# Altium project LimePSB-RPCM_1v3.PrjPcb (part 9 of 14)

## Sheet 12_Clock_2.SchDoc: Clock 2
size A3; Organization: Lime Microsystems; Address1: Surrey Tech Centre; Address2: Guildford GU2 7YG; Address3: Surrey; Address4: United Kingdom; Revision: v1.3; SheetNumber: 12; SheetTotal: 15
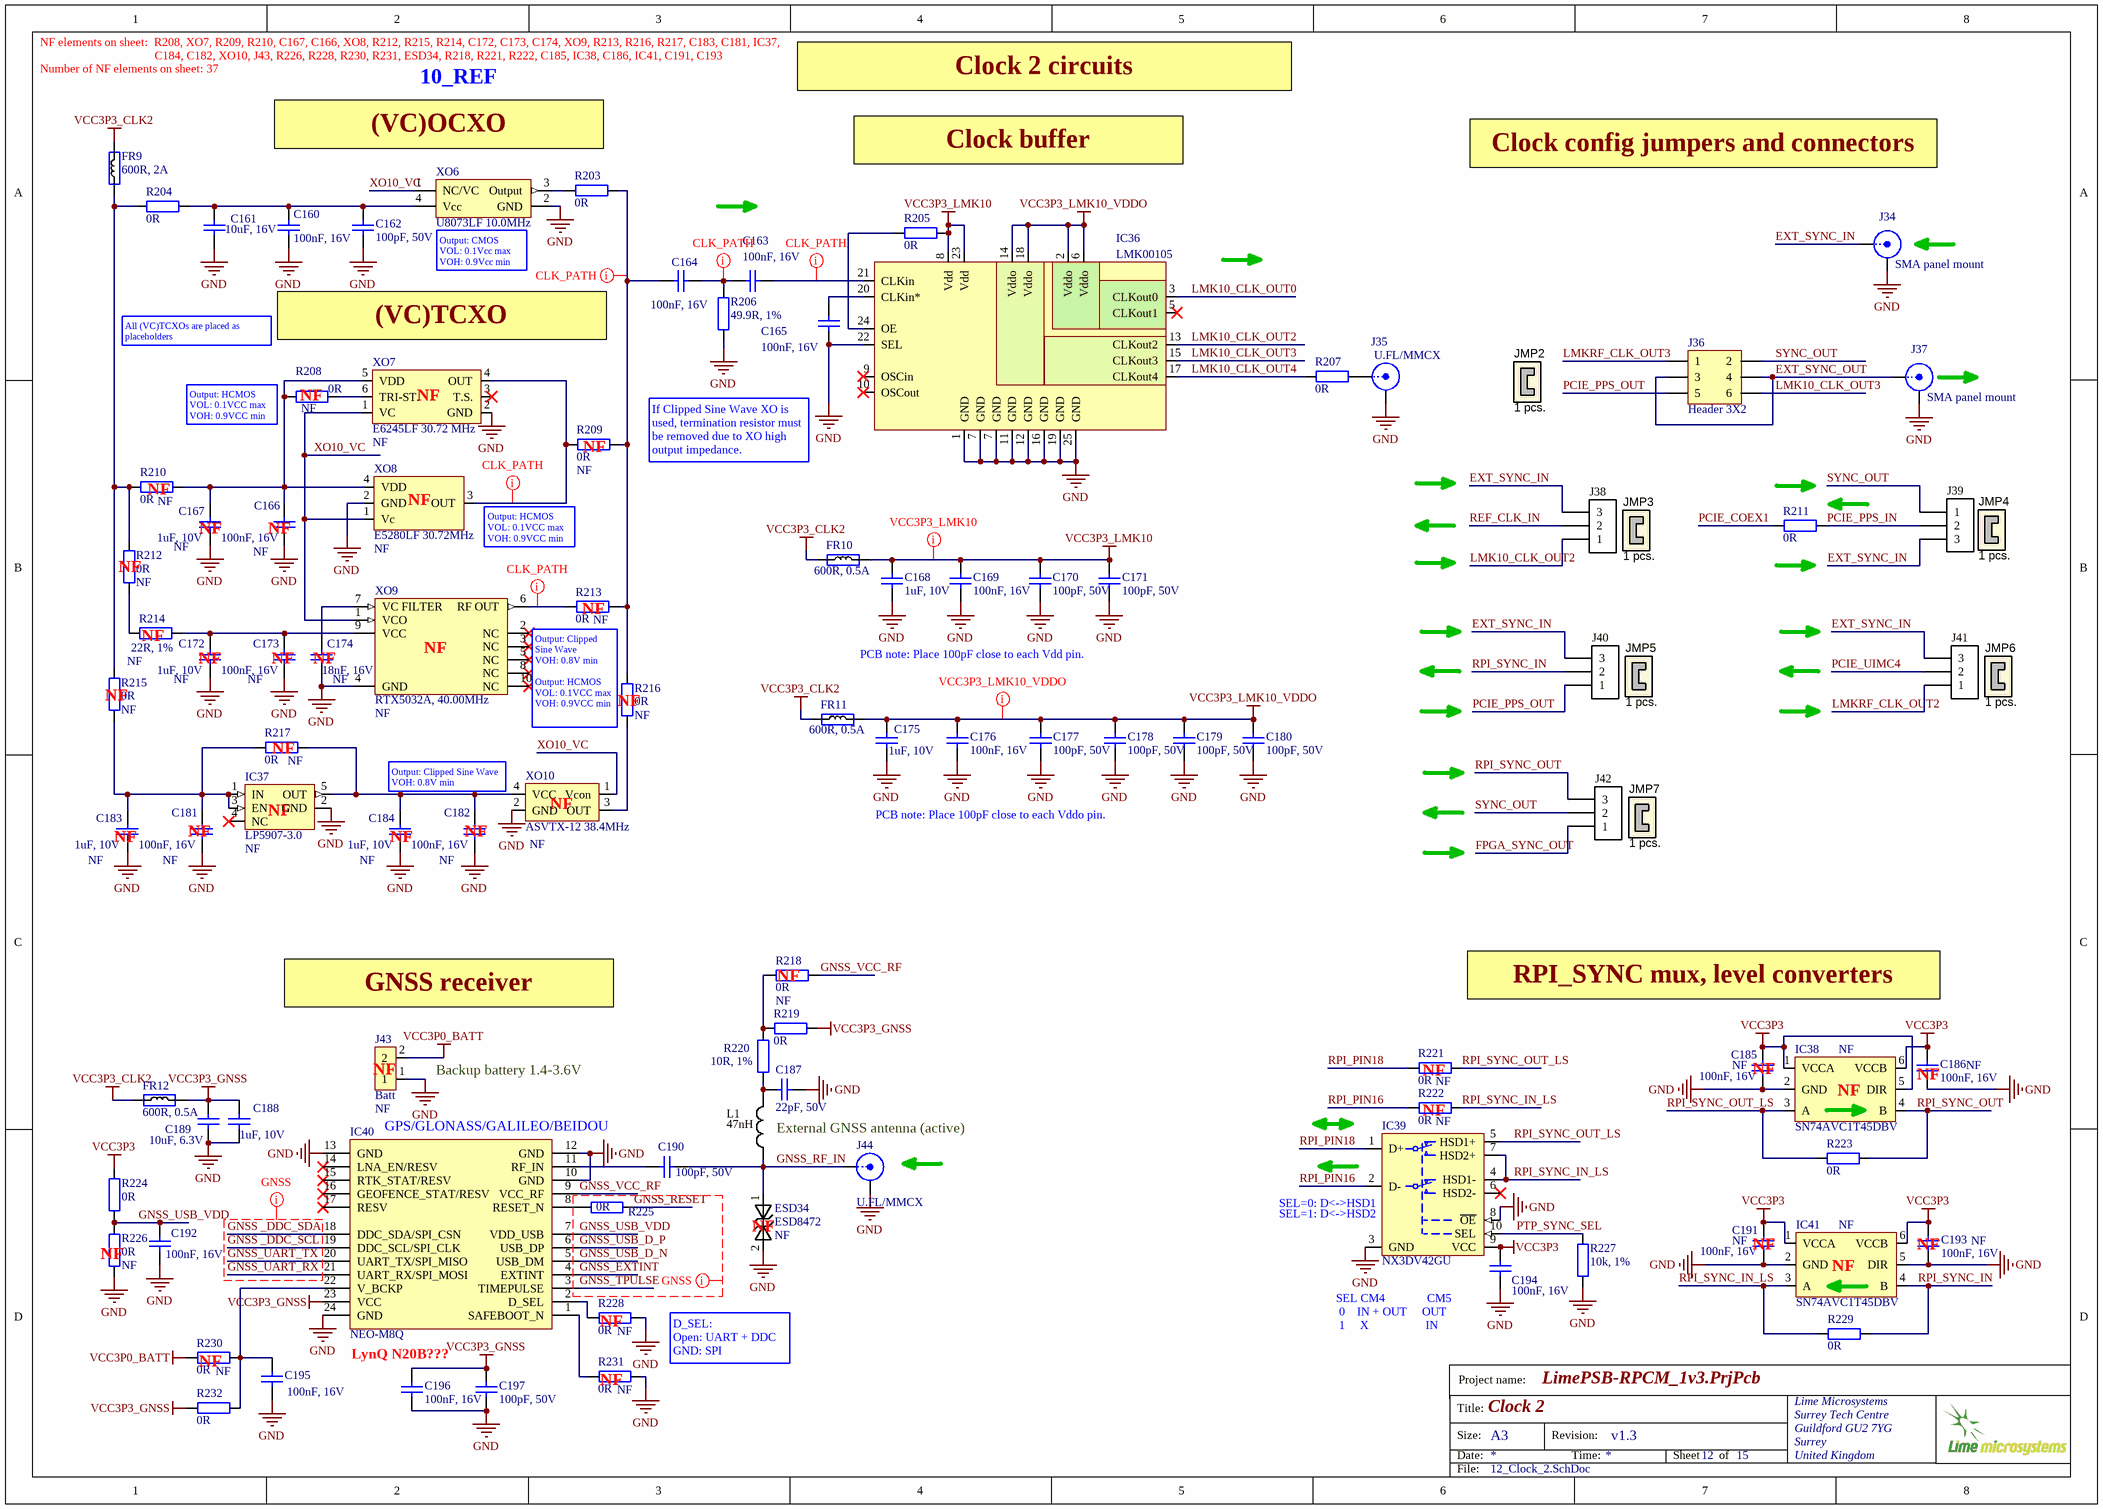
[diagram p11: 12_Clock_2.SchDoc]

### Parts
C160  100nF, 16V  [CAP0402]
C161  10uF, 16V  [CAP0603]
C162  100pF, 50V  [CAP0402]
C163  100nF, 16V  [CAP0402]
C164  100nF, 16V  [CAP0402]
C165  100nF, 16V  [CAP0402]
C166  100nF, 16V  Assembly Info: NF  [CAP0402]
C167  1uF, 10V  Assembly Info: NF  [CAP0402]
C168  1uF, 10V  [CAP0402]
C169  100nF, 16V  [CAP0402]
C170  100pF, 50V  [CAP0402]
C171  100pF, 50V  [CAP0402]
C172  1uF, 10V  Assembly Info: NF  [CAP0402]
C173  100nF, 16V  Assembly Info: NF  [CAP0402]
C174  18nF, 16V  Assembly Info: NF  [CAP0402]
C175  1uF, 10V  [CAP0402]
C176  100nF, 16V  [CAP0402]
C177  100pF, 50V  [CAP0402]
C178  100pF, 50V  [CAP0402]
C179  100pF, 50V  [CAP0402]
C180  100pF, 50V  [CAP0402]
C181  100nF, 16V  Assembly Info: NF  [CAP0402]
C182  100nF, 16V  Assembly Info: NF  [CAP0402]
C183  1uF, 10V  Assembly Info: NF  [CAP0402]
C184  1uF, 10V  Assembly Info: NF  [CAP0402]
C185  100nF, 16V  Assembly Info: NF  [CAP0402]
C186  100nF, 16V  Assembly Info: NF  [CAP0402]
C187  22pF, 50V  [CAP0402]
C188  1uF, 10V  [CAP0402]
C189  10uF, 6.3V  [CAP0603]
C190  100pF, 50V  [CAP0402]
C191  100nF, 16V  Assembly Info: NF  [CAP0402]
C192  100nF, 16V  [CAP0402]
C193  100nF, 16V  Assembly Info: NF  [CAP0402]
C194  100nF, 16V  [CAP0402]
C195  100nF, 16V  [CAP0402]
C196  100nF, 16V  [CAP0402]
C197  100pF, 50V  [CAP0402]
ESD34  ESD8472  Assembly Info: NF  [ESD8472_X3DFN2]
FR9  600R, 2A  [RES0805]
FR10  600R, 0.5A  [RES0402]
FR11  600R, 0.5A  [RES0402]
FR12  600R, 0.5A  [RES0402]
IC36  LMK00105  [LMK00105SQ]
IC37  LP5907-3.0  Assembly Info: NF  [SOT23-5]
IC38  SN74AVC1T45DBV  Assembly Info: NF  [SOT23-6]
IC39  NX3DV42GU  [FSUSB42UMX]
IC40  NEO-M8Q  [NEO-7M/8M]
IC41  SN74AVC1T45DBV  Assembly Info: NF  [SOT23-6]
J34  SMA panel mount  [SMA_connector_side]
J35  U.FL/MMCX  [MMCX_UFL_conn_u]
J36  Header 3X2  [Header3x2]
J37  SMA panel mount  [SMA_connector_side]
J38  Header 3x1 pin  [HDR_1x3]  (value not drawn)
J39  Header 3x1 pin  [HDR_1x3]  (value not drawn)
J40  Header 3x1 pin  [HDR_1x3]  (value not drawn)
J41  Header 3x1 pin  [HDR_1x3]  (value not drawn)
J42  Header 3x1 pin  [HDR_1x3]  (value not drawn)
J43  Batt  Assembly Info: NF  [HDR_1x2]
J44  U.FL/MMCX  [MMCX_UFL_conn_u]
JMP2  1 pcs.  (mechanical)
JMP3  1 pcs.  (mechanical)
JMP4  1 pcs.  (mechanical)
JMP5  1 pcs.  (mechanical)
JMP6  1 pcs.  (mechanical)
JMP7  1 pcs.  (mechanical)
L1  47nH  [RES0402]
R203  0R  [RES0402_v2]
R204  0R  [RES0402]
R205  0R  [RES0402]
R206  49.9R, 1%  [RES0402]
R207  0R  [RES0402]
R208  0R  Assembly Info: NF  [RES0402]
R209  0R  Assembly Info: NF  [RES0402_v2]
R210  0R  Assembly Info: NF  [RES0402]
R211  0R  [RES0402]
R212  0R  Assembly Info: NF  [RES0402]
R213  0R  Assembly Info: NF  [RES0402_v2]
R214  22R, 1%  Assembly Info: NF  [RES0402]
R215  0R  Assembly Info: NF  [RES0402]
R216  0R  Assembly Info: NF  [RES0402_v2]
R217  0R  Assembly Info: NF  [RES0402]
R218  0R  Assembly Info: NF  [RES0402]
R219  0R  [RES0402]
R220  10R, 1%  [RES0402]
R221  0R  Assembly Info: NF  [RES0402]
R222  0R  Assembly Info: NF  [RES0402]
R223  0R  [RES0402]
R224  0R  [RES0402]
R225  0R  [RES0402]
R226  0R  Assembly Info: NF  [RES0402]
R227  10k, 1%  [RES0402]
R228  0R  Assembly Info: NF  [RES0402]
R229  0R  [RES0402]
R230  0R  Assembly Info: NF  [RES0402]
R231  0R  Assembly Info: NF  [RES0402]
R232  0R  [RES0402]
XO6  U8073LF 10.0MHz  [AOCJYR-10.000MHz]
XO7  E6245LF 30.72 MHz  Assembly Info: NF  [RAKON_RPT7050A]
XO8  E5280LF 30.72MHz  Assembly Info: NF  [RAKON_TXCO]
XO9  RTX5032A, 40.00MHz  Assembly Info: NF  [RAKON_RTX5032A]
XO10  ASVTX-12 38.4MHz  Assembly Info: NF  [CRYSTAL_4-LCC_2P5x2P0]

### Nets
GND: C160.1 C161.1 C162.2 C165.1 C166.1 C167.1 C168.1 C169.1 C170.1 C171.1 C172.1 C173.1 C174.1 C175.1 C176.1 C177.1 C178.1 C179.1 C180.1 C181.1 C182.1 C183.1 C184.1 C185.2 C186.2 C187.1 C188.1 C189.1 C191.2 C192.2 C193.2 C194.2 C195.2 C196.1 C197.2 ESD34.2 IC36.1(GND) IC36.7(GND) IC36.11(GND) IC36.12(GND) IC36.16(GND) IC36.19(GND) IC36.22(SEL) IC36.25(GND) IC37.2(GND) IC38.2(GND) IC39.3(GND) IC39.8(~{OE}) IC40.10(GND) IC40.12(GND) IC40.13(GND) IC40.24(GND) IC41.2(GND) IC41.5(DIR) J34.2(Y) J35.2(Y) J37.2(Y) J43.1 J44.2(Y) R206.1 R226.1 R227.2 R228.1 R231.1 XO6.2(GND) XO7.2(GND) XO8.2(GND) XO9.4(GND) XO10.2(GND)
VCC3P0_BATT: J43.2 R230.2
VCC3P3: C185.1 C186.1 C191.1 C193.1 C194.1 IC38.1(VCCA) IC38.5(DIR) IC38.6(VCCB) IC39.9(VCC) IC41.1(VCCA) IC41.6(VCCB) R224.1
VCC3P3_CLK2: FR9.1 FR10.1 FR11.1 FR12.1
VCC3P3_GNSS: C188.2 C189.2 C196.2 C197.1 FR12.2 IC40.23(VCC) R219.1 R232.2
VCC3P3_LMK10: C168.2 C169.2 C170.2 C171.2 FR10.2 IC36.8(Vdd) IC36.23(Vdd) R205.2
VCC3P3_LMK10_VDDO: C175.2 C176.2 C177.2 C178.2 C179.2 C180.2 FR11.2 IC36.2(Vddo) IC36.6(Vddo) IC36.14(Vddo) IC36.18(Vddo)
EXT_SYNC_IN: J34.1(X) J38.3 J39.3 J40.3 J41.3
EXT_SYNC_OUT: J36.3 J36.4 J37.1(X)
FPGA_SYNC_OUT: J42.1
GNSS _DDC_SCL: IC40.19(DDC_SCL/SPI_CLK)
GNSS _DDC_SDA: IC40.18(DDC_SDA/SPI_CSN)
GNSS_EXTINT: IC40.4(EXTINT)
GNSS_RESET: R225.1
GNSS_RF_IN: C190.1 ESD34.1 J44.1(X) L1.1
GNSS_TPULSE: IC40.3(TIMEPULSE)
GNSS_UART_RX: IC40.21(UART_RX/SPI_MOSI)
GNSS_UART_TX: IC40.20(UART_TX/SPI_MISO)
GNSS_USB_D_N: IC40.5(USB_DM)
GNSS_USB_D_P: IC40.6(USB_DP)
GNSS_USB_VDD: C192.1 IC40.7(VDD_USB) R224.2 R226.2
GNSS_VCC_RF: IC40.9(VCC_RF) R218.2
LMK10_CLK_OUT0: IC36.3(CLKout0)
LMK10_CLK_OUT2: IC36.13(CLKout2) J38.1
LMK10_CLK_OUT3: IC36.15(CLKout3) J36.6
LMK10_CLK_OUT4: IC36.17(CLKout4) R207.2
LMKRF_CLK_OUT2: J41.1
LMKRF_CLK_OUT3: J36.1
PCIE_COEX1: R211.2
PCIE_PPS_IN: J39.2 R211.1
PCIE_PPS_OUT: J36.5 J40.1
PCIE_UIMC4: J41.2
PTP_SYNC_SEL: IC39.10(SEL) R227.1
REF_CLK_IN: J38.2
RPI_PIN16: IC39.2(D-) R222.2
RPI_PIN18: IC39.1(D+) R221.2
RPI_SYNC_IN: IC41.4(B) J40.2 R229.1
RPI_SYNC_IN_LS: IC39.4(HSD1-) IC39.7(HSD2+) IC41.3(A) R222.1 R229.2
RPI_SYNC_OUT: IC38.4(B) J42.3 R223.1
RPI_SYNC_OUT_LS: IC38.3(A) IC39.5(HSD1+) R221.1 R223.2
SYNC_OUT: J36.2 J39.1 J42.2
XO10_VC: XO6.1(NC/VC) XO7.1(VC) XO8.1(Vc) XO9.1(VCO) XO10.1(Vcon)
NetC160_2: C160.2 C161.2 C162.1 R204.2 XO6.4(Vcc)
NetC163_1: C163.1 IC36.21(CLKin)
NetC163_2: C163.2 C164.1 R206.2
NetC164_2: C164.2 R203.1 R209.1 R213.2 R216.1
NetC165_2: C165.2 IC36.20(CLKin*)
NetC166_2: C166.2 C167.2 R208.2 R210.1 XO7.5(VDD) XO8.4(VDD)
NetC172_2: C172.2 C173.2 R214.2 XO9.9(VCC)
NetC174_2: C174.2 XO9.7(VC_FILTER)
NetC181_2: C181.2 C183.2 IC37.1(IN) IC37.3(EN) R215.2 R217.2
NetC182_2: C182.2 C184.2 IC37.5(OUT) R217.1 XO10.4(VCC)
NetC187_2: C187.2 L1.2 R220.1
NetC190_2: C190.2 IC40.11(RF_IN)
NetC195_1: C195.1 IC40.22(V_BCKP) R230.1 R232.1
NetFR9_2: FR9.2 R204.1 R210.2 R212.1 R215.1
NetIC36_24: IC36.24(OE) R205.1
NetIC40_1: IC40.1(SAFEBOOT_N) R231.2
NetIC40_2: IC40.2(D_SEL) R228.2
NetIC40_8: IC40.8(RESET_N) R225.2
NetJ35_1: J35.1(X) R207.1
NetR203_2: R203.2 XO6.3(Output)
NetR208_1: R208.1 XO7.6(TRI-ST.)
NetR209_2: R209.2 XO7.4(OUT) XO8.3(OUT)
NetR212_2: R212.2 R214.1
NetR213_1: R213.1 XO9.6(RF_OUT)
NetR216_2: R216.2 XO10.3(OUT)
NetR218_1: R218.1 R219.2 R220.2

Not connected (* = marked no-connect by the designer): IC36 5(CLKout1)* 9(OSCin)* 10(OSCout)*; IC37 4(NC)*; IC39 6(HSD2-)*; IC40 14(LNA_EN/RESV)* 15(RTK_STAT/RESV)* 16(GEOFENCE_STAT/RESV)* 17(RESV)*; JMP2 1 2; JMP3 1 2; JMP4 1 2; JMP5 1 2; JMP6 1 2; JMP7 1 2; XO7 3(T.S.)*; XO9 2(NC)* 3(NC)* 5(NC)* 8(NC)* 10(NC)*

### Layout directives
net class CLK_PATH: NetC163_1, NetC163_2, NetC164_2, NetR209_2, NetR213_1
net class VCC3P3_LMK10: VCC3P3_LMK10
net class VCC3P3_LMK10_VDDO: VCC3P3_LMK10_VDDO
net class GNSS: GNSS _DDC_SCL, GNSS _DDC_SDA, GNSS_EXTINT, GNSS_RESET, GNSS_TPULSE, GNSS_UART_RX, GNSS_UART_TX, GNSS_USB_D_N, GNSS_USB_D_P, GNSS_USB_VDD

### Notes on the sheet
- NF elements on sheet:  R208, XO7, R209, R210, C167, C166, XO8, R212, R215, R214, C172, C173, C174, XO9, R213, R216, R217, C183, C181, IC37,
- Number of NF elements on sheet: 37
- C184, C182, XO10, J43, R226, R228, R230, R231, ESD34, R218, R221, R222, C185, IC38, C186, IC41, C191, C193
- 10_REF
- Clock 2 circuits
- (VC)OCXO
- Clock buffer
- Clock config jumpers and connectors
- (near XO6) Output: CMOS
  VOL: 0.1Vcc max
  VOH: 0.9Vcc min
- All (VC)TCXOs are placed as placeholders
- (VC)TCXO
- (near R208) Output: HCMOS
  VOL: 0.1VCC max
  VOH: 0.9VCC min
- (near R208) NF
- (near XO7) NF
- (near R209) NF
- (near R210) NF
- (near XO8) NF
- (near R209) If Clipped Sine Wave XO is used, termination resistor must be removed due to XO high output impedance.
- (near R212) NF
- (near C167) NF
- (near C166) NF
- (near XO8) Output: HCMOS
  VOL: 0.1VCC max
  VOH: 0.9VCC min
- (near R214) NF
- (near XO9) NF
- (near R213) NF
- (near R215) NF
- (near C172) NF
- (near C173) NF
- (near C174) NF
- (near R216) Output: Clipped Sine Wave
  VOH: 0.8V min
  Output: HCMOS
  VOL: 0.1VCC max
  VOH: 0.9VCC min
- (near R216) NF
- PCB note: Place 100pF close to each Vdd pin.
- (near R217) NF
- Output: Clipped Sine Wave
  VOH: 0.8V min
- (near C183) NF
- (near C181) NF
- (near IC37) NF
- (near C184) NF
- (near C182) NF
- (near XO10) NF
- PCB note: Place 100pF close to each Vddo pin.
- (near R218) NF
- (near J43) GNSS receiver
- RPI_SYNC mux, level converters
- (near J43) NF
- (near J43) Backup battery 1.4-3.6V
- (near R221) NF
- (near R222) NF
- (near C185) NF
- (near IC38) NF
- (near C186) NF
- (near IC40) GPS/GLONASS/GALILEO/BEIDOU
- (near L1) External GNSS antenna (active)
- (near R226) NF
- (near ESD34) NF
- (near IC39) SEL=0: D<->HSD1
- (near IC39) SEL=1: D<->HSD2
- (near C191) NF
- (near C193) NF
- (near R228) NF
- (near IC41) NF
- (near R230) NF
- LynQ N20B???
- (near R231) NF
- D_SEL:
  Open: UART + DDC
  GND: SPI
- (near C194) SEL CM4              CM5
  0    IN + OUT     OUT
  1     X                   IN
- Project name:
- Title:
- Size:
- Date:
- A3
- Revision:
- Time:
- Sheet
- of
- File:

### Library data of the parts
C160 C163-C166 C169 C173 C176 C185 C186 C191 C193 C194 = Cap_0402: as C101-C108 on sheet 10_USB_HDMI; Value: 100nF, 16V; Supplier 1: Mouser; Supplier Part Number 1: 81-GRM155R71C104KA88; Case Code - in: 0402; RoHS: RoHS Compliant; Operating Temperature Range: - 55 C to + 125 C; Series: GRM; Termination Style: SMD/SMT; Package / Case: 0402 (1005 metric); Voltage Rating DC: 16 V; Maximum Operating Temperature: + 125 C; Case Code - mm: 1005; Minimum Operating Temperature: - 55 C; Product Category: Low & Medium Capacitance SMD Ceramic Chip Capacitors; Packaging: Reel; Product: General Type MLCCs; Category: Multilayer Ceramic Capacitors MLCC - SMD/SMT; Brand: Murata Electronics; Case Width: 0.5 mm; RoHS - Mouser: Y; Standard Pack Qty: 10000; Minimum Order Quantity: 1; Reeling: True; Manufacturer Part Number 1: GRM155R71C104KA88D
C161 = Cap_0603: as C110 on sheet 11_Clock_1; Value: 10uF, 16V; Supplier 1: Digi-Key; Supplier Part Number 1: 490-7201-2-ND; Category: Capacitors; Ratings: -; Features: -; Lead Style: -; Package / Case: 0603 (1608 Metric); Lead Spacing: -; Applications: General Purpose; Voltage - Rated: 16V; Operating Temperature: -55°C ~ 85°C; Thickness (Max): 0.039" (1.00mm); Mounting Type: Surface Mount, MLCC; RoHS: RoHS Compliant; Size / Dimension: 0.063" L x 0.031" W (1.60mm x 0.80mm); Packaging: Tape & Reel (TR); Height - Seated (Max): -
C162 C190 C197 = Cap_0402: as C111 on sheet 11_Clock_1; Value: 100pF, 50V; Capacitance: 100pF; Thickness (Max): 0.022" (0.55mm); Size / Dimension: 0.039" L x 0.020" W (1.00mm x 0.50mm); RoHS: RoHS Compliant; Ratings: -; Package / Case: 0402 (1005 Metric); Mounting Type: Surface Mount, MLCC; Height - Seated (Max): -; Features: -; Lead Spacing: -; Voltage - Rated: 50V; Operating Temperature: -55°C ~ 125°C; Packaging: Cut Tape (CT); Applications: General Purpose; Lead Style: -; Supplier 1: Digi-Key; Category: Capacitors; Supplier Part Number 1: 311-1024-1-ND
C167 C172 = Cap_0402: as C116 on sheet 11_Clock_1; Value: 1uF, 10V; Supplier 1: Digi-Key; Supplier Part Number 1: 311-1732-1-ND; RoHS: YES; MSL: -
C168 C175 C188 = Cap_0402: as C117 on sheet 11_Clock_1; Value: 1uF, 10V; Supplier 1: Digi-Key; Supplier Part Number 1: 311-1732-1-ND; RoHS: RoHS Compliant; Applications: General Purpose; Category: Capacitors; ComponentLink1Description: http://www.yageo.com/documents/recent/UPY-GPHC_X5R_4V-to-50V_25.pdf; ComponentLink1URL: http://www.yageo.com/documents/recent/UPY-GPHC_X5R_4V-to-50V_25.pdf; Failure Rate: -; Features: -; Height - Seated (Max): -; Lead Spacing: -; Lead Style: -; Mounting Type: Surface Mount, MLCC; Operating Temperature: -55°C ~ 85°C; Package / Case: 0402 (1005 Metric); Packaging: Cut Tape (CT); Part Status: Active; Pricing 1: 1=0.22, 10=0.156, 100=0.0732, 500=0.0513, 1000=0.04248, 2500=0.03953, 5000=0.03617 (USD); Ratings: -; Size / Dimension: 0.039" L x 0.020" W (1.00mm x 0.50mm); Stock 1: 69600; Temperature Coefficient: X5R; Thickness (Max): 0.022" (0.55mm); Voltage - Rated: 10V
C170 C171 C177-C180 = Cap_0402: as C119 on sheet 11_Clock_1; Value: 100pF, 50V; Supplier 1: Digi-Key; Supplier Part Number 1: 311-1024-1-ND; RoHS: RoHS Compliant; Category: Capacitors; Applications: General Purpose; Mounting Type: Surface Mount, MLCC; Capacitance: 100pF; Ratings: -; Packaging: Cut Tape (CT); Voltage - Rated: 50V; Size / Dimension: 0.039" L x 0.020" W (1.00mm x 0.50mm); Height - Seated (Max): -; Package / Case: 0402 (1005 Metric); Operating Temperature: -55°C ~ 125°C; Features: -; Lead Spacing: -; Lead Style: -; Thickness (Max): 0.022" (0.55mm)
C174 = Cap_0402: as C123 on sheet 11_Clock_1; Value: 18nF, 16V; Supplier 1: Digi-Key; Supplier Part Number 1: 311-1706-1-ND; Part Status: Active; Category: Capacitors; Packaging: Cut Tape (CT); Voltage - Rated: 16V; RoHS: RoHS Compliant; Size / Dimension: 0.039" L x 0.020" W (1.00mm x 0.50mm); Package / Case: 0402 (1005 Metric); Mounting Type: Surface Mount, MLCC; Thickness (Max): 0.022" (0.55mm); Applications: General Purpose; Operating Temperature: -55°C ~ 125°C
C181 C182 = Cap_0402: as C93 on sheet 10_USB_HDMI; Value: 100nF, 16V; Supplier 1: Mouser; Supplier Part Number 1: 81-GRM155R71C104KA88; Case Code - in: 0402; RoHS: RoHS Compliant; Operating Temperature Range: - 55 C to + 125 C; Series: GRM; Termination Style: SMD/SMT; Package / Case: 0402 (1005 metric); Voltage Rating DC: 16 V; Maximum Operating Temperature: + 125 C; Case Code - mm: 1005; Minimum Operating Temperature: - 55 C; Product Category: Low & Medium Capacitance SMD Ceramic Chip Capacitors; Packaging: Reel; Product: General Type MLCCs; Category: Multilayer Ceramic Capacitors MLCC - SMD/SMT; Brand: Murata Electronics; Case Width: 0.5 mm; RoHS - Mouser: Y; Standard Pack Qty: 10000; Minimum Order Quantity: 1; Reeling: True; Manufacturer Part Number: GRM155R71C104KA88D
C183 C184 = Cap_0402: as C92 on sheet 10_USB_HDMI; Value: 1uF, 10V; Supplier 1: Digi-Key; Supplier Part Number 1: 311-1732-1-ND; MSL: -; RoHS: YES
C187 = Cap_0402: as C154-C156 on sheet 11_Clock_1; Value: 22pF, 50V; Supplier 1: Digi-Key; Supplier Part Number 1: 311-1018-2-ND; Category: Capacitors; Voltage - Rated: 50V; Packaging: Tape & Reel (TR); RoHS: RoHS Compliant; Capacitance: 22pF; Operating Temperature: -55°C ~ 125°C; Mounting Type: Surface Mount, MLCC; Height - Seated (Max): -; Size / Dimension: 0.039" L x 0.020" W (1.00mm x 0.50mm); Ratings: -; Applications: General Purpose; Thickness (Max): 0.022" (0.55mm); Lead Spacing: -; Lead Style: -; Features: -; Package / Case: 0402 (1005 Metric)
C189 = Cap_0603: Manufacturer Part Number 1: CC0603MRX5R5BB106; Manufacturer: Yageo; Part Description: 10µF ±20% 6.3V X5R Ceramic Capacitor -55°C ~ 85°C Surface Mount, MLCC 0603 (1608 Metric) 0.063" L x 0.031" W (1.60mm x 0.80mm); Capacitance: 10µF; Tolerance: ±20%; Supplier 1: Digi-Key; Supplier Part Number 1: 311-1448-2-ND; Package / Case: 0603 (1608 Metric); Category: Capacitors; Voltage - Rated: 6.3V; Value: 10uF, 6.3V
C192 C195 = Cap_0603: Manufacturer Part Number 1: GRM155R71C104KA88D; Part Description: 0.10µF ±10% 16V X7R Ceramic Capacitor -55°C ~ 125°C Surface Mount, MLCC 0402 (1005 Metric) 0.039" L x 0.020" W (1.00mm x 0.50mm); Brand: Murata Electronics; Tolerance: 10 %; Type: General Purpose MLCC; Capacitance: 0.1 uF; Temperature Coefficient / Code: +/- 15 %; Case Height: 0.5 mm; Case Length: 1 mm; Dielectric: X7R; Supplier 1: Mouser; Supplier Part Number 1: 81-GRM155R71C104KA88; Case Code - in: 0402; Manufacturer: Murata Electronics; Category: Multilayer Ceramic Capacitors MLCC - SMD/SMT; Voltage Rating DC: 16 V; Value: 100nF, 16V; Manufacturer Part Number: GRM155R71C104KA88D; Case Code - mm: 1005; Case Width: 0.5 mm; Maximum Operating Temperature: + 125 C; Minimum Operating Temperature: - 55 C; Minimum Order Quantity: 1; Operating Temperature Range: - 55 C to + 125 C; Package / Case: 0402 (1005 metric); Packaging: Reel; Product: General Type MLCCs; Product Category: Low & Medium Capacitance SMD Ceramic Chip Capacitors; Reeling: True; RoHS - Mouser: Y; RoHS: RoHS Compliant; Series: GRM; Standard Pack Qty: 10000; Termination Style: SMD/SMT
C196 = Cap_0402: Manufacturer: Murata Electronics; Manufacturer Part Number: GRM155R71C104KA88D; Part Description: 0.10µF ±10% 16V X7R Ceramic Capacitor -55°C ~ 125°C Surface Mount, MLCC 0402 (1005 Metric) 0.039" L x 0.020" W (1.00mm x 0.50mm); Tolerance: 10 %; Type: General Purpose MLCC; Capacitance: 0.1 uF; Case Length: 1 mm; Dielectric: X7R; Case Height: 0.5 mm; Temperature Coefficient / Code: +/- 15 %; Value: 100nF, 16V; Supplier 1: Mouser; Supplier Part Number 1: 81-GRM155R71C104KA88; Case Code - in: 0402; RoHS: RoHS Compliant; Operating Temperature Range: - 55 C to + 125 C; Series: GRM; Termination Style: SMD/SMT; Package / Case: 0402 (1005 metric); Voltage Rating DC: 16 V; Maximum Operating Temperature: + 125 C; Case Code - mm: 1005; Minimum Operating Temperature: - 55 C; Product Category: Low & Medium Capacitance SMD Ceramic Chip Capacitors; Packaging: Reel; Product: General Type MLCCs; Category: Multilayer Ceramic Capacitors MLCC - SMD/SMT; Brand: Murata Electronics; Case Width: 0.5 mm; RoHS - Mouser: Y; Standard Pack Qty: 10000; Minimum Order Quantity: 1; Reeling: True; Manufacturer Part Number 1: GRM155R71C104KA88D
ESD34 = ESD8472: Manufacturer: ON Semiconductor; Manufacturer Part Number: ESD8472MUT5G; Part Description: TVS DIODE 5.3VWM 14VC X3DFN2; Voltage - Reverse Standoff (Typ): 5.3V (Max); Voltage - Breakdown (Min): 7V; Voltage - Clamping (Max) @ Ipp: 14V; Current - Peak Pulse (10/1000µs): 3A (8/20µs); Power Line Protection: No; Capacitance @ Frequency: 0.2pF @ 1MHz; Supplier 1: Digi-Key; RoHS: RoHS Compliant; Category: Circuit Protection; Stock 1: 2295; Pricing 1: 1=0.39, 10=0.315, 100=0.2142, 500=0.16068, 1000=0.12051 (USD); Packaging: Cut Tape (CT); Part Status: Active; Type: Zener; Power - Peak Pulse: -; Applications: Automotive, RF Antenna; Operating Temperature: -55°C ~ 150°C (TJ); Mounting Type: Surface Mount; Package / Case: 2-XFDFN; Supplier Device Package: 2-X3DFN (0.62x0.32); ComponentLink1URL: http://www.onsemi.com/pub/Collateral/ESD8472-D.PDF; ComponentLink1Description: http://www.onsemi.com/pub/Collateral/ESD8472-D.PDF; Supplier Part Number 1: ESD8472MUT5GOSCT-ND; Manufacturer Part Number 1: ESD8472MUT5G
FR9 = Ferrite: as FR4 on sheet 11_Clock_1; Supplier 1: Digi-Key; Supplier Part Number 1: 445-2206-2-ND; Value: 600R, 2A; Category: Filters; Current Rating: 2A; Height (Max): 0.041" (1.05mm); Mounting Type: Surface Mount; Package / Case: 0805 (2012 Metric); Packaging: Tape & Reel (TR); RoHS: RoHS Compliant; Size / Dimension: 0.079" L x 0.049" W (2.00mm x 1.25mm)
FR10-FR12 = Ferrite: as FR5-FR8 on sheet 11_Clock_1; Value: 600R, 0.5A; Supplier 1: Digi-Key; Supplier Part Number 1: 490-5441-1-ND; Stock 1: 416370; Pricing 1: 1=0.1, 10=0.06, 25=0.0552, 50=0.0496, 100=0.0363, 250=0.0264, 500=0.0242, 1000=0.0209, 5000=0.0165 (USD); Case/Package: 0402; Number of Pins: 2; Case Code (Metric): 1005; Case Code (Imperial): 0402; Core Material: Ferrite; Material: Steel,Ferrite; Min Operating Temperature: -55°C; Max Operating Temperature: 125°C; Package Quantity: 1; Packaging: Tape and Reel; Series: BLM15AX_SN; Impedance: 600R; Max Current Rating: 500mA; Termination: SMD/SMT; Max DC Current: 500mA; Number of Circuits: 1; DC Resistance-Max: 340mR; Length: 1mm; Width: 0.5mm; Height: 0.5mm; Depth: 0.5mm; REACH SVHC: No SVHC; Lead Free: Lead Free; RoHS Compliant: Yes; ComponentLink1URL: https://www.murata.com/en-us/products/productdata/8796740059166/ENFA0018.pdf?src-supplier=Digi-Key; ComponentLink1Description: https://www.murata.com/en-us/products/productdata/8796740059166/ENFA0018.pdf?src-supplier=Digi-Key; ComponentLink2URL: http://search.murata.co.jp/Ceramy/image/img/PDF/ENG/L0110S0100BLM15AX_SN.pdf?src-supplier=Future+Electronics; ComponentLink2Description: http://search.murata.co.jp/Ceramy/image/img/PDF/ENG/L0110S0100BLM15AX_SN.pdf?src-supplier=Future+Electronics; ComponentLink3URL: http://www.produktinfo.conrad.com/datenblaetter/1100000-1199999/001171675-da-01-en-CHIP_DROSSEL0402_600R_420MA_1_0X0_5MM.pdf?src-supplier=Conrad; ComponentLink3Description: http://www.produktinfo.conrad.com/datenblaetter/1100000-1199999/001171675-da-01-en-CHIP_DROSSEL0402_600R_420MA_1_0X0_5MM.pdf?src-supplier=Conrad; ComponentLink4URL: http://www.produktinfo.conrad.com/datenblaetter/1100000-1199999/001172169-da-01-en-DROSSEL_0402_600R_1_0X0_5MM_10000ST.pdf?src-supplier=Conrad; ComponentLink4Description: http://www.produktinfo.conrad.com/datenblaetter/1100000-1199999/001172169-da-01-en-DROSSEL_0402_600R_1_0X0_5MM_10000ST.pdf?src-supplier=Conrad
IC36 = LMK00105: as IC30 on sheet 11_Clock_1; Supplier 1: Digi-Key; Type: Fanout Buffer (Distribution), Multiplexer, Translator; Category: Integrated Circuits (ICs); Operating Temperature: -40°C ~ 85°C; Package / Case: 24-WFQFN Exposed Pad; Supplier Device Package: 24-WQFN (4x4); Supplier Part Number 1: LMK00105SQ/NOPBCT-ND
IC37 = LP5907: as IC31 on sheet 11_Clock_1; Supplier 1: Digi-Key; Stock 1: 90911; Pricing 1: 1 = 0,65000, 10 = 0,56000, 100 = 0,41820, 500 = 0,32858, 1000 = 0,25390 (USD); RoHS: Yes; Mount: Surface Mount; Case/Package: SOT-23-5; Min Operating Temperature: -40°C; Max Operating Temperature: 125°C; Packaging: Tape and Reel; Output Current: 250mA; Number of Regulators: 1; Radiation Hardening: No; Lead Free: Lead Free; ComponentLink1URL: https://datasheet.ciiva.com/48677/lp5907-q1-48677562.pdf?src-supplier=Avnet; ComponentLink1Description: https://datasheet.ciiva.com/48677/lp5907-q1-48677562.pdf?src-supplier=Avnet; Supplier Part Number 1: 296-40364-1-ND
IC38 IC41 = SN74AVC1T45DBV: Manufacturer: Texas Instruments; Manufacturer Part Number 1: SN74AXC1T45DBVR; Part Description: Voltage Level Translator Bidirectional 1 Circuit 1 Channel 500Mbps SOT-23-6; Number of Bits: 1; Channel Type: Bidirectional; Data Rate: 500Mbps; Supplier 1: Digi-Key; Supplier Part Number 1: 296-47598-1-ND; Stock 1: 116252; Pricing 1: 1=0,68000, 10=0,59800, 25=0,56200, 100=0,45860, 250=0,42596, 500=0,36252, 1000=0,29002 (USD); RoHS: Yes; Mount: Surface Mount; Case/Package: SOT-23-6; Min Operating Temperature: -40°C; Max Operating Temperature: 125°C; Packaging: Cut Tape; Number of Circuits: 1; RoHS Compliant: Yes; ComponentLink1URL: http://www.ti.com/lit/ds/symlink/sn74axc1t45.pdf?src-supplier=Digi-Key; ComponentLink1Description: http://www.ti.com/lit/ds/symlink/sn74axc1t45.pdf?src-supplier=Digi-Key; ComponentLink2URL: http://www.ti.com/general/docs/suppproductinfo.tsp?distId=10&amp;gotoUrl=http%3A%2F%2Fwww.ti.com%2Flit%2Fgpn%2Fsn74axc1t45&src-supplier=Digi-Key; ComponentLink2Description: http://www.ti.com/general/docs/suppproductinfo.tsp?distId=10&amp;gotoUrl=http%3A%2F%2Fwww.ti.com%2Flit%2Fgpn%2Fsn74axc1t45&src-supplier=Digi-Key
IC39 = FSUSB42UMX: as IC25 on sheet 10_USB_HDMI; ComponentLink1URL: https://www.fairchildsemi.com/datasheets/FS/FSUSB42.pdf; ComponentLink1Description: https://www.fairchildsemi.com/datasheets/FS/FSUSB42.pdf; Supplier 1: Digikey; Supplier Part Number 1: 568-12388-1-ND; Stock 1: 3109; Pricing 1: 1=0,89, 10=0,781, 25=0,7336, 100=0,5987, 250=0,55612, 500=0,47328, 1000=0,37863 (USD); RoHS: Yes; ComponentLink2URL: http://www.mouser.com/ds/2/302/NX3DV42-1127466.pdf?src-supplier=Mouser; ComponentLink2Description: http://www.mouser.com/ds/2/302/NX3DV42-1127466.pdf?src-supplier=Mouser; ComponentLink3URL: http://www.nxp.com/documents/data_sheet/NX3DV42.pdf?src-supplier=Avnet; ComponentLink3Description: http://www.nxp.com/documents/data_sheet/NX3DV42.pdf?src-supplier=Avnet; ComponentLink4URL: http://www.nxp.com/documents/data_sheet/NX3DV42.pdf?src-supplier=Digikey; ComponentLink4Description: http://www.nxp.com/documents/data_sheet/NX3DV42.pdf?src-supplier=Digikey; ComponentLink5URL: https://www.nxp.com/docs/en/data-sheet/NX3DV42.pdf?src-supplier=Digikey; ComponentLink5Description: https://www.nxp.com/docs/en/data-sheet/NX3DV42.pdf?src-supplier=Digikey
IC40 = NEO-M8P_M8M: GNSS engine for GPS/QZSS, GLONASS; Manufacturer: U-blox; Manufacturer Part Number 1: NEO-M8Q-0; Part Description: IC RECEIVER GPS/GNSS 24LCC; Frequency: 1.575GHz; Sensitivity: -167dBm; Modulation or Protocol: BeiDou, Galileo, GLONASS, GNSS, GPS; Current - Receiving: 21mA; Data Interface: I2C, SPI, UART, USB; Voltage - Supply: 1.65 V ~ 3.6 V; DatasheetVersion: R07 11-Nov-2014; PackageDescription: NEO-7 series 12.2 x 16 x 2.4 mm; ComponentLink1URL: https://www.u-blox.com/en/product/neo-7-series; ComponentLink2Description: Datasheet; ComponentLink1Description: https://www.u-blox.com/en/product/neo-7-series; Supplier 1: Digi-Key; Supplier Part Number 1: 672-1009-1-ND; RoHS: RoHS Compliant; Category: RF/IF and RFID; Stock 1: 444; Pricing 1: 1=30.59, 10=26.65, 50=17.3, 100=13.169 (USD); Packaging: Cut Tape (CT); Part Status: Active; Data Rate (Max): -; Applications: General Purpose; Memory Size: -; Antenna Connector: -; Features: -; Operating Temperature: -40°C ~ 85°C; Package / Case: 24-SMD Module; Supplier Device Package: -; ComponentLink3URL: https://www.u-blox.com/sites/default/files/NEO-M8-FW3_DataSheet_(UBX-15031086).pdf; ComponentLink3Description: https://www.u-blox.com/sites/default/files/NEO-M8-FW3_DataSheet_(UBX-15031086).pdf
J34 J37 = RF_IF_connector: CONN SMA JACK STR 50OHM EDGE MNT; Manufacturer: Linx; Manufacturer Part Number 1: CONSMA002-L-G; Part Description: SMA Connector Receptacle, Female Socket 50Ohm Panel Mount, Through Hole, Right Angle Solder; Supplier 1: Digi-Key; Supplier Part Number 1: CONSMA002-L-G-ND; Stock 1: 815; Pricing 1: 1=4.08, 25=3.67, 100=3.32, 250=3.25, 500=3, 1000=2.80001, 2000=2.5875 (USD)
J35 J44 = RF_IF_connector: as J33 on sheet 11_Clock_1; Cable Group: -; Category: Connectors, Interconnects; Fastening Type: Snap-On; Features: -; Housing Color: Silver; Ingress Protection: -; Mounting Type: Surface Mount; Operating Temperature: -40°C ~ 90°C; Packaging: Cut Tape (CT); RoHS: RoHS Compliant; Shield Termination: Solder; Supplier 1: Digi-Key; Supplier Part Number 1: WM5587CT-ND; Part Description: CONN UMC RCPT STR 50 OHM SMD
J36 = Header 3X2: Header, 2-Pin, Dual row; Manufacturer 1: Adam Equipment; Manufacturer Part Number: PH2-06-UA; Part Description: Connector Header Through Hole 6 position 0.100" (2.54mm); ComponentLink1URL: http://uk.rs-online.com/webdocs/1406/0900766b81406898.pdf; ComponentLink1Description: http://uk.rs-online.com/webdocs/1406/0900766b81406898.pdf; ComponentLink2URL: https://www.verical.com/server-webapp/html/getDatasheet?partID=483857; ComponentLink2Description: https://www.verical.com/server-webapp/html/getDatasheet?partID=483857; ComponentLink3URL: http://www.farnell.com/cad/112195.pdf; ComponentLink3Description: http://www.farnell.com/cad/112195.pdf; Supplier 1: Digi-Key; Supplier Part Number 1: 2057-PH2-06-UA-ND; Stock 1: 59749; Pricing 1: 1=0,13000, 10=0,10400, 100=0,07640, 500=0,06326, 1000=0,05535, 5000=0,04744, 10000=0,04612 (USD); RoHS: Yes; Lead Free: Lead Free; ComponentLink4URL: https://datasheet.ciiva.com/16479/page-292-295-16479745.pdf?src-supplier=Future+Electronics; ComponentLink4Description: https://datasheet.ciiva.com/16479/page-292-295-16479745.pdf?src-supplier=Future+Electronics; Manufacturer: Adam Equipment; Manufacturer Part Number 1: PH2-06-UA
J38-J42 = Header3P: Header, 3-pin; Manufacturer 1: Wurth Electronics; Manufacturer Part Number: 61300311121; Part Description: Connector Header Through Hole 3 position 0.100" (2.54mm); Number of Positions: 3; Gender: Male; Connector Type: Male Pin; Pitch: 0.1inch; Supplier 1: Digi-Key; Supplier Part Number 1: 732-5316-ND; Stock 1: 95926; Pricing 1: 1=0,13000, 10=0,11300, 25=0,09400, 50=0,07900, 100=0,07100, 1000=0,06600 (USD); RoHS: Yes; Mount: Through Hole; Contact Plating: Gold; Contact Material: Copper; Color: Black; Number of Rows: 1; Packaging: Bulk; Termination: Solder; Number of Contacts: 3; Contact Mating Length: 0.236inch; REACH SVHC: Unknown; Lead Free: Lead Free; RoHS Compliant: Yes; ComponentLink1URL: http://www.farnell.com/cad/1737268.pdf?src-supplier=Element14; ComponentLink1Description: http://www.farnell.com/cad/1737268.pdf?src-supplier=Element14; ComponentLink2URL: https://katalog.we-online.de/em/datasheet/6130xx11121.pdf?src-supplier=Digi-Key; ComponentLink2Description: https://katalog.we-online.de/em/datasheet/6130xx11121.pdf?src-supplier=Digi-Key; Manufacturer: Wurth Electronics; Manufacturer Part Number 1: 61300311121
J43 = Jumper: Manufacturer Part Number 1: 961102-6404-AR; Part Description: 2 Positions Header, Unshrouded Connector 0.100" (2.54mm) Through Hole Gold; Manufacturer: 3M; Connector Type: Header, Unshrouded; Supplier 1: Digi-Key; Supplier Part Number 1: 3M9447-ND; Contact Type: Male Pin; Color: Black; Mounting Type: Through Hole; Category: Connectors, Interconnects; Contact Finish: Gold
JMP2-JMP7 = JUMP_2P_CONN_HEADER: Shorting Jumper, 2-position, 1.27mm pitch; Part Description: 2 (1 x 2) Position Shunt Connector Black Closed Top 0.100" (2.54mm) Gold; Manufacturer: Sullins; Manufacturer Part Number 1: SPC02SYAN; Number of Positions: 2; Pitch: 0.1inch; Supplier 1: Digi-Key; Supplier Part Number 1: S9001-ND; Stock 1: 570741; Pricing 1: 1=0.1, 10=0.059, 25=0.044, 50=0.0378, 100=0.0365, 250=0.03152, 500=0.03024, 1000=0.02646, 2500=0.02394 (USD); Colour: Black; Contact Plating: Gold; Package Quantity: 1000; Packaging: Bulk; Height: 0.256inch; Lead Free: Lead Free; ComponentLink1URL: http://www.sullinscorp.com/images/SPC02SYAN-0-3293.pdf; ComponentLink1Description: http://www.sullinscorp.com/images/SPC02SYAN-0-3293.pdf; ComponentLink2URL: https://drawings-pdf.s3.amazonaws.com/11134.pdf; ComponentLink2Description: https://drawings-pdf.s3.amazonaws.com/11134.pdf
L1 = Inductor_0603: Manufacturer: COILCRAFT; Manufacturer Part Number: 0402HP-47NXJLU; Part Description: INDUCTOR, RF, 47NH, 5%, 2.4GHZ, SMD; Product Range:0402HP Series; Inductance:47nH; Inductance Tolerance:± 5%; High Frequency Inductor Case:0402 [1005 Metric]; Self Resonant Frequency Min:2.4GHz; DC Resistance Max:0.58ohm; DC Current Rating:420mA; SVHC: No SVHC (15-Jun-2015); Inductance Tolerance: ± 5%; High Frequency Inductor Case: 0402 [1005 Metric]; Inductance: 47; DC Resistance Max: 0.58; Self Resonant Frequency Min: 2.4; Product Range: 0402; DC Current Rating: 420; Inductor Construction: Wirewound; Supplier 1: Farnell; Supplier Part Number 1: 2285856; Packaging: Cut Tape; Inductor Case Style: 0402 [1005 Metric]; RoHS: Y-EX; value: 47nH; Manufacturer Part Number 1: 0402HP-47NXJLU
R203-R205 R207-R213 R215-R219 R221 R222 R224-R226 R228 R230-R232 = Res_0402: as R150 on sheet 10_USB_HDMI; Value: 0R; Supplier 1: Digi-Key; Supplier Part Number 1: 311-0.0JRTR-ND; Category: Resistors; Temperature Coefficient: -; Features: Moisture Resistant; Supplier Device Package: 0402; Height: 0.016" (0.40mm); Package / Case: 0402 (1005 Metric); Operating Temperature: -55°C ~ 155°C; Size / Dimension: 0.039" L x 0.020" W (1.00mm x 0.50mm); Composition: Thick Film; Packaging: Tape & Reel (TR); Number of Terminations: 2; RoHS: RoHS Compliant
R206 = Res_0402: as R168 on sheet 11_Clock_1; Number of Terminations: 2; Size / Dimension: 0.039" L x 0.020" W (1.00mm x 0.50mm); Supplier Device Package: 0402 (1005 Metric); RoHS: RoHS Compliant; Supplier Part Number 1: 1276-3469-6-ND; Features: -; Packaging: Digi-Reel®; Tolerance: ±1%; Height: 0.016" (0.40mm); Category: Resistors; Composition: Thick Film; Package / Case: 0402 (1005 Metric); Supplier 1: Digi-Key; Operating Temperature: -55°C ~ 155°C; Value: 49.9R, 1%
R214 = Res_0402: as R174 on sheet 11_Clock_1; Supplier 1: Digi-Key; Supplier Part Number 1: 311-22.0LRTR-ND; Tolerance: ±1%; Supplier Device Package: 0402; Composition: Thick Film; Category: Resistors; Value: 22R, 1%
R220 = Res_0402: as R183 on sheet 11_Clock_1; Value: 10R, 1%; Supplier 1: Digi-Key; Supplier Part Number 1: RMCF0402FT10R0CT-ND; Stock 1: 4909487; Pricing 1: 1=0,10000, 10=0,01400, 100=0,00560, 1000=0,00253, 2500=0,00220, 5000=0,00181 (USD); RoHS: Yes; Mount: Surface Mount; Case/Package: 0402; Case Code (Metric): 1005; Case Code (Imperial): 0402; Contact Plating: Tin,Matte; Size Code: 0402; Min Operating Temperature: -55°C; Max Operating Temperature: 155°C; Resistance: 10R; Tolerance: 1%; Packaging: Tape and Reel; Resistor Type: Thick Film; Number of Terminations: 2; Max Power Dissipation: 63mW; Features: Automotive AEC-Q200; Series: RMCF; Construction: Rectangular; Length: 0.039inch; Width: 0.02inch; Height: 0.016inch; Depth: 0.5mm; Radiation Hardening: No; Lead Free: Lead Free; Military Standard: Not; RoHS Compliant: Yes; ComponentLink1URL: http://components.arrow.com/part/dataview/44988361S6966751N1174?src-supplier=Arrow+Electronics; ComponentLink1Description: http://components.arrow.com/part/dataview/44988361S6966751N1174?src-supplier=Arrow+Electronics; ComponentLink2URL: https://www.seielect.com/catalog/SEI-RMCF_RMCP.pdf?src-supplier=Avnet; ComponentLink2Description: https://www.seielect.com/catalog/SEI-RMCF_RMCP.pdf?src-supplier=Avnet; ComponentLink3URL: https://www.seielect.com/catalog/SEI-Packaging.pdf?src-supplier=Digi-Key; ComponentLink3Description: https://www.seielect.com/catalog/SEI-Packaging.pdf?src-supplier=Digi-Key; ComponentLink4URL: http://www.seielect.com/Catalog/SEI-RMCF_RMCP.pdf?src-supplier=Future+Electronics; ComponentLink4Description: http://www.seielect.com/Catalog/SEI-RMCF_RMCP.pdf?src-supplier=Future+Electronics
R223 R229 = Res_0402: Manufacturer: Yageo; Part Description: RES SMD 0.0OHM JUMPER 1/16W 0402; Manufacturer Part Number 1: RC0402JR-070RL; Power (Watts): 0.063W, 1/16W; Resistance (Ohms): 0.0; Tolerance: Jumper; Supplier 1: Digi-Key; Supplier Part Number 1: 311-0.0JRTR-ND; Composition: Thick Film; Package / Case: 0402 (1005 Metric); Category: Resistors; Value: 0R; Features: Moisture Resistant; Height: 0.016" (0.40mm); Number of Terminations: 2; Operating Temperature: -55°C ~ 155°C; Packaging: Tape & Reel (TR); RoHS: RoHS Compliant; Size / Dimension: 0.039" L x 0.020" W (1.00mm x 0.50mm); Supplier Device Package: 0402; Temperature Coefficient: -
R227 = Res_0402: as R151 on sheet 10_USB_HDMI; Value: 10k, 1%; Supplier 1: Digi-Key; Supplier Part Number 1: 311-10.0KLRTR-ND; Resistance (Ohms): 10k; Packaging: Tape & Reel (TR); RoHS: RoHS Compliant; Package / Case: 0402 (1005 Metric); Tolerance: ±1%; Operating Temperature: -55°C ~ 155°C; Size / Dimension: 0.039" L x 0.020" W (1.00mm x 0.50mm); Number of Terminations: 2; Category: Resistors; Height: 0.016" (0.40mm); Supplier Device Package: 0402; Features: Moisture Resistant; Composition: Thick Film
XO6 = AOCJYR-10.000MHz: Manufacturer: Rakon; Part Description: ROM9070PA 10.0MHz MERC+ 9x7 HOT CMOS 3.3V PULL; Oscillator Output Compatibility: CMOS; Oscillator Case: SMD, 9.7mm x 7.5; Supply Voltage Nom: 3.3; Frequency Nom, MHz: 10.0; Frequency Stability +/-, ppb: 20; Manufacturer Part Number 1: U8073LF; Supplier Part Number 1: U8073LF; Supplier 1: Rakon
XO7 = RPT7050A: as XO2 on sheet 11_Clock_1; Manufacturer Part Number 1: E6245LF; Supplier 1: Rakon; Supplier Part Number 1: E6245LF
XO8 = TXCO: as XO3 on sheet 11_Clock_1; Manufacturer Part Number 1: E5280LF; Supplier 1: Rakon; Supplier Part Number 1: E5280LF
XO9 = Rakon_RTX5032A: as XO4 on sheet 11_Clock_1; Manufacturer Part Number 1: RTX5032A; Supplier Part Number 1: RTX5032A; Supplier 1: RAKON
XO10 = ASVTX-12-A-38.400MHZ-H10-T_CRYSTAL: as XO5 on sheet 11_Clock_1; Supplier 1: Digi-Key; Manufacturer Part Number 1: ASVTX-12-A-38.400MHZ-H10-T; Stock 1: 1680; Pricing 1: 1 = 3,58000, 10 = 3,41000, 50 = 3,23960, 100 = 2,89850, 500 = 2,72800 (USD); RoHS: Yes; Mount: Surface Mount; Case/Package: SMD/SMT; Min Operating Temperature: -30°C; Max Operating Temperature: 85°C; Frequency: 38.4MHz; Package Quantity: 1000; Packaging: Tape and Reel; Termination: SMD/SMT; Length: 0.098inch; Height: 0.035inch; Width: 0.079inch; ComponentLink1URL: https://datasheet.ciiva.com/5466/astx12-asvtx12-8609-5466673.pdf?src-supplier=Mouser; ComponentLink1Description: https://datasheet.ciiva.com/5466/astx12-asvtx12-8609-5466673.pdf?src-supplier=Mouser; ComponentLink2URL: https://datasheet.ciiva.com/867/astx12-asvtx12-867453.pdf?src-supplier=Digi-Key; ComponentLink2Description: https://datasheet.ciiva.com/867/astx12-asvtx12-867453.pdf?src-supplier=Digi-Key; ComponentLink3URL: https://datasheet.ciiva.com/867/astx12-asvtx12-867454.pdf?src-supplier=Digi-Key; ComponentLink3Description: https://datasheet.ciiva.com/867/astx12-asvtx12-867454.pdf?src-supplier=Digi-Key; ComponentLink4URL: https://datasheet.ciiva.com/867/astx12-asvtx12-867455.pdf?src-supplier=Digi-Key; ComponentLink4Description: https://datasheet.ciiva.com/867/astx12-asvtx12-867455.pdf?src-supplier=Digi-Key; Supplier Part Number 1: 535-11790-1-ND